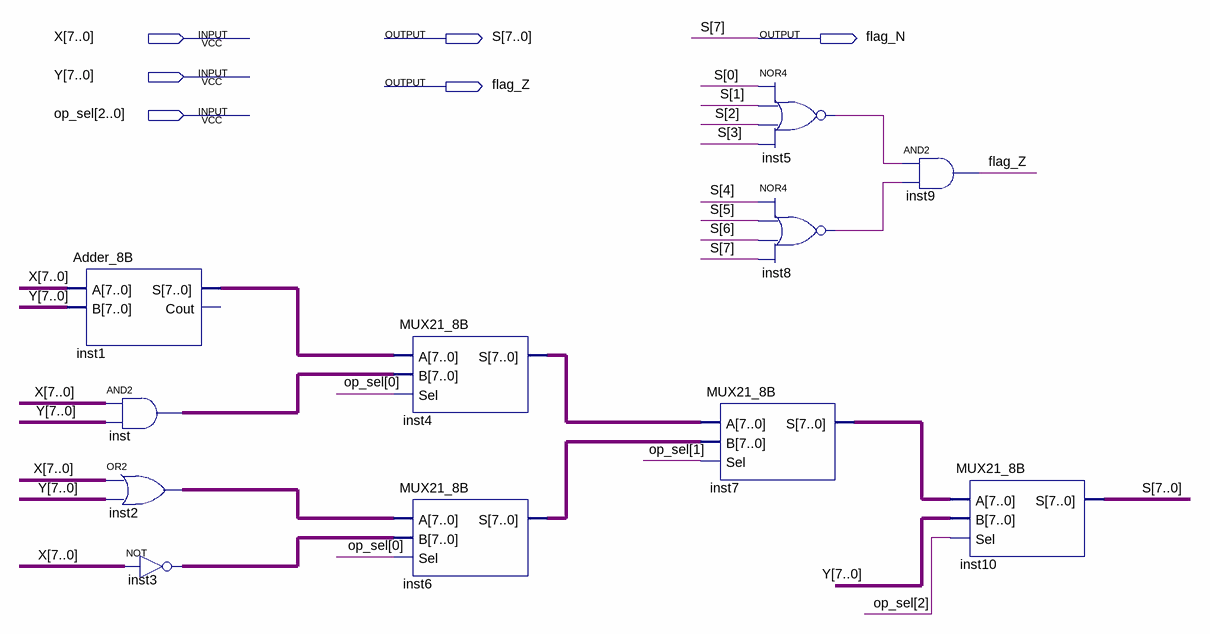
[diagram p0: schematic sheet]
// Quartus schematic ULA.bdf as structural Verilog: 11 symbols, 6 pins
module ULA (
  input  [7:0] X,
  input  [7:0] Y,
  input  [2:0] op_sel,
  output [7:0] S,
  output flag_N,
  output flag_Z
);

  wire inst5_out, inst8_out;
  wire [7:0] inst1_s, inst2_out, inst3_out, inst4_s, inst6_s, inst7_s, inst_out;

  Adder_8B inst1 (.A(X), .B(Y), .S(inst1_s));  // open: Cout
  assign inst_out = X & Y;  // AND2 inst, 8 bits wide
  assign inst2_out = X | Y;  // OR2 inst2, 8 bits wide
  assign inst3_out = ~X;  // NOT inst3, 8 bits wide
  MUX21_8B inst4 (.A(inst1_s), .B(inst_out), .Sel(op_sel[0]), .S(inst4_s));
  MUX21_8B inst6 (.A(inst2_out), .B(inst3_out), .Sel(op_sel[0]), .S(inst6_s));
  nor inst5 (inst5_out, S[0], S[1], S[2], S[3]);
  nor inst8 (inst8_out, S[4], S[5], S[6], flag_N);
  MUX21_8B inst7 (.A(inst4_s), .B(inst6_s), .Sel(op_sel[1]), .S(inst7_s));
  and inst9 (flag_Z, inst5_out, inst8_out);
  MUX21_8B inst10 (.A(inst7_s), .B(Y), .Sel(op_sel[2]), .S({flag_N, S[6:0]}));

  assign S[7] = flag_N;
endmodule
